# Altium schematic sheet Sheet2.SchDoc
size A4; SheetNumber: 2; SheetTotal: 2
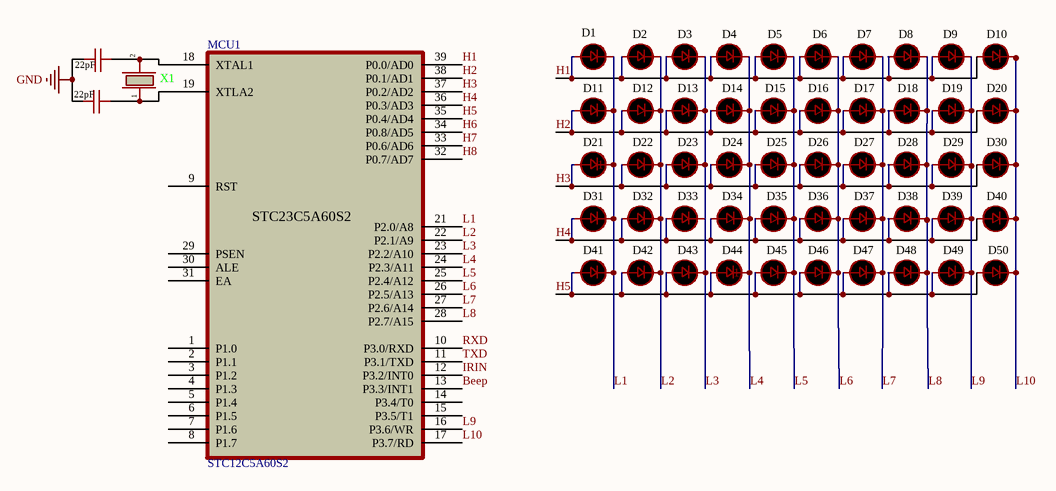
[diagram p0: Sheet2.SchDoc]

## Parts
(Parts that share a designator on the sheet are numbered #1, #2 ... from top to bottom, then left to right.)
C1  22pF  [Capacitor]
C2  22pF  [Capacitor]
LED2#1  D1  [LED2]
LED2#2  D2  [LED2]
LED2#3  D3  [LED2]
LED2#4  D4  [LED2]
LED2#5  D5  [LED2]
LED2#6  D6  [LED2]
LED2#7  D7  [LED2]
LED2#8  D8  [LED2]
LED2#9  D9  [LED2]
LED2#10  D10  [LED2]
LED2#11  D11  [LED2]
LED2#12  D12  [LED2]
LED2#13  D13  [LED2]
LED2#14  D14  [LED2]
LED2#15  D15  [LED2]
LED2#16  D16  [LED2]
LED2#17  D17  [LED2]
LED2#18  D18  [LED2]
LED2#19  D19  [LED2]
LED2#20  D20  [LED2]
LED2#21  D21  [LED2]
LED2#22  D22  [LED2]
LED2#23  D23  [LED2]
LED2#24  D24  [LED2]
LED2#25  D25  [LED2]
LED2#26  D26  [LED2]
LED2#27  D27  [LED2]
LED2#28  D28  [LED2]
LED2#29  D29  [LED2]
LED2#30  D30  [LED2]
LED2#31  D31  [LED2]
LED2#32  D32  [LED2]
LED2#33  D33  [LED2]
LED2#34  D34  [LED2]
LED2#35  D35  [LED2]
LED2#36  D36  [LED2]
LED2#37  D37  [LED2]
LED2#38  D38  [LED2]
LED2#39  D39  [LED2]
LED2#40  D40  [LED2]
LED2#41  D41  [LED2]
LED2#42  D42  [LED2]
LED2#43  D43  [LED2]
LED2#44  D44  [LED2]
LED2#45  D45  [LED2]
LED2#46  D46  [LED2]
LED2#47  D47  [LED2]
LED2#48  D48  [LED2]
LED2#49  D49  [LED2]
LED2#50  D50  [LED2]
MCU1  STC12C5A60S2  [STC12C5A60S2]
X1  X1  [Crystal]

## Nets
GND: C1.2 C2.2
Beep: MCU1.13(P3.3/INT1)
H1: LED2#1.1 LED2#2.1 LED2#3.1 LED2#4.1 LED2#5.1 LED2#6.1 LED2#7.1 LED2#8.1 LED2#9.1 LED2#10.1 MCU1.39(P0.0/AD0)
H2: LED2#11.1 LED2#12.1 LED2#13.1 LED2#14.1 LED2#15.1 LED2#16.1 LED2#17.1 LED2#18.1 LED2#19.1 LED2#20.1 MCU1.38(P0.1/AD1)
H3: LED2#21.1 LED2#22.1 LED2#23.1 LED2#24.1 LED2#25.1 LED2#26.1 LED2#27.1 LED2#28.1 LED2#29.1 LED2#30.1 MCU1.37(P0.2/AD2)
H4: LED2#31.1 LED2#32.1 LED2#33.1 LED2#34.1 LED2#35.1 LED2#36.1 LED2#37.1 LED2#38.1 LED2#39.1 LED2#40.1 MCU1.36(P0.3/AD3)
H5: LED2#41.1 LED2#42.1 LED2#43.1 LED2#44.1 LED2#45.1 LED2#46.1 LED2#47.1 LED2#48.1 LED2#49.1 LED2#50.1 MCU1.35(P0.4/AD4)
H6: MCU1.34(P0.8/AD5)
H7: MCU1.33(P0.6/AD6)
H8: MCU1.32(P0.7/AD7)
IRIN: MCU1.12(P3.2/INT0)
L1: LED2#1.2 LED2#11.2 LED2#21.2 LED2#31.2 LED2#41.2 MCU1.21(P2.0/A8)
L2: LED2#2.2 LED2#12.2 LED2#22.2 LED2#32.2 LED2#42.2 MCU1.22(P2.1/A9)
L3: LED2#3.2 LED2#13.2 LED2#23.2 LED2#33.2 LED2#43.2 MCU1.23(P2.2/A10)
L4: LED2#4.2 LED2#14.2 LED2#24.2 LED2#34.2 LED2#44.2 MCU1.24(P2.3/A11)
L5: LED2#5.2 LED2#15.2 LED2#25.2 LED2#35.2 LED2#45.2 MCU1.25(P2.4/A12)
L6: LED2#6.2 LED2#16.2 LED2#26.2 LED2#36.2 LED2#46.2 MCU1.26(P2.5/A13)
L7: LED2#7.2 LED2#17.2 LED2#27.2 LED2#37.2 LED2#47.2 MCU1.27(P2.6/A14)
L8: LED2#8.2 LED2#18.2 LED2#28.2 LED2#38.2 LED2#48.2 MCU1.28(P2.7/A15)
L9: LED2#9.2 LED2#19.2 LED2#29.2 LED2#39.2 LED2#49.2 MCU1.16(P3.6/WR)
L10: LED2#10.2 LED2#20.2 LED2#30.2 LED2#40.2 LED2#50.2 MCU1.17(P3.7/RD)
RXD: MCU1.10(P3.0/RXD)
TXD: MCU1.11(P3.1/TXD)
NetC1_1: C1.1 MCU1.18(XTAL1) X1.2
NetC2_1: C2.1 MCU1.19(XTLA2) X1.1

Not connected (* = marked no-connect by the designer): MCU1 1(P1.0) 2(P1.1) 3(P1.2) 4(P1.3) 5(P1.4) 6(P1.5) 7(P1.6) 8(P1.7) 9(RST) 14(P3.4/T0) 15(P3.5/T1) 29(PSEN) 30(ALE) 31(EA)

## Notes on the sheet
- (in symbol STC12C5A60S2) STC23C5A60S2

## Library data of the parts
C1 C2 = Capacitor
LED2#1-LED2#50 = LED2
X1 = Crystal